# Altium schematic sheet KB1.SchDoc
size A1
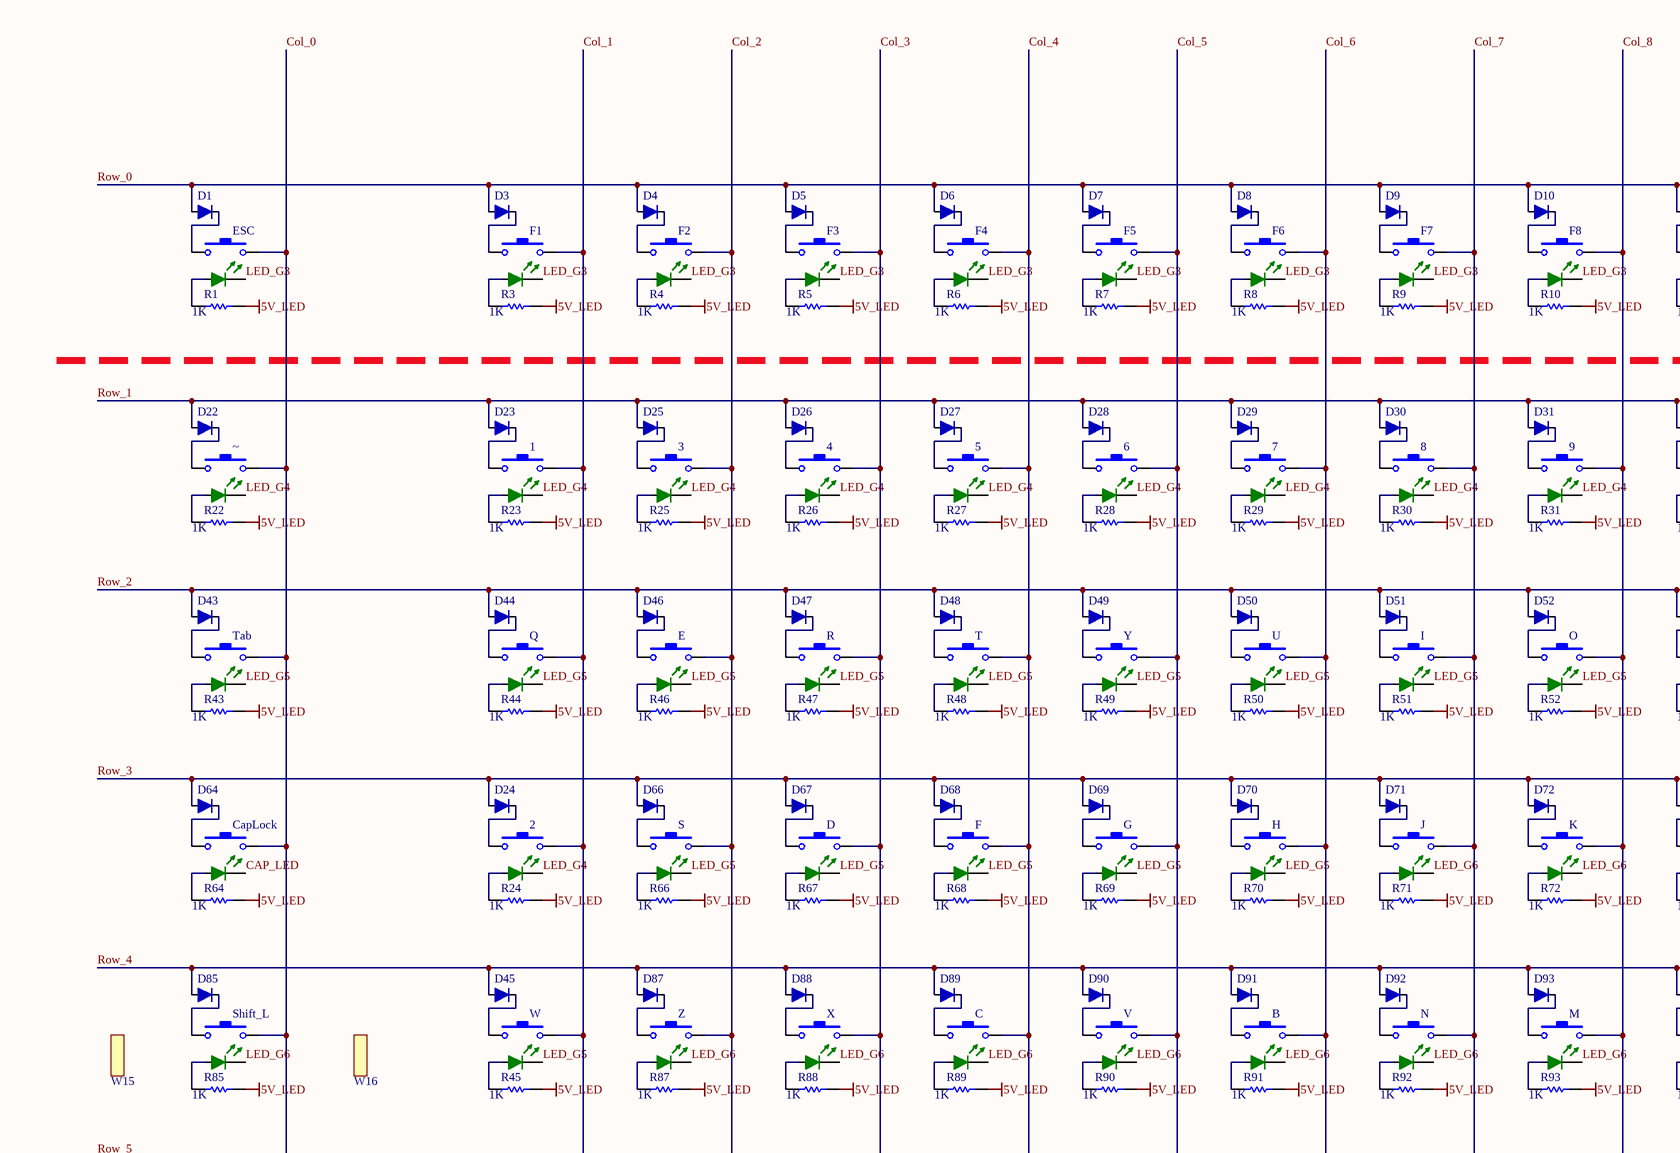
[diagram p0: KB1.SchDoc, top left]
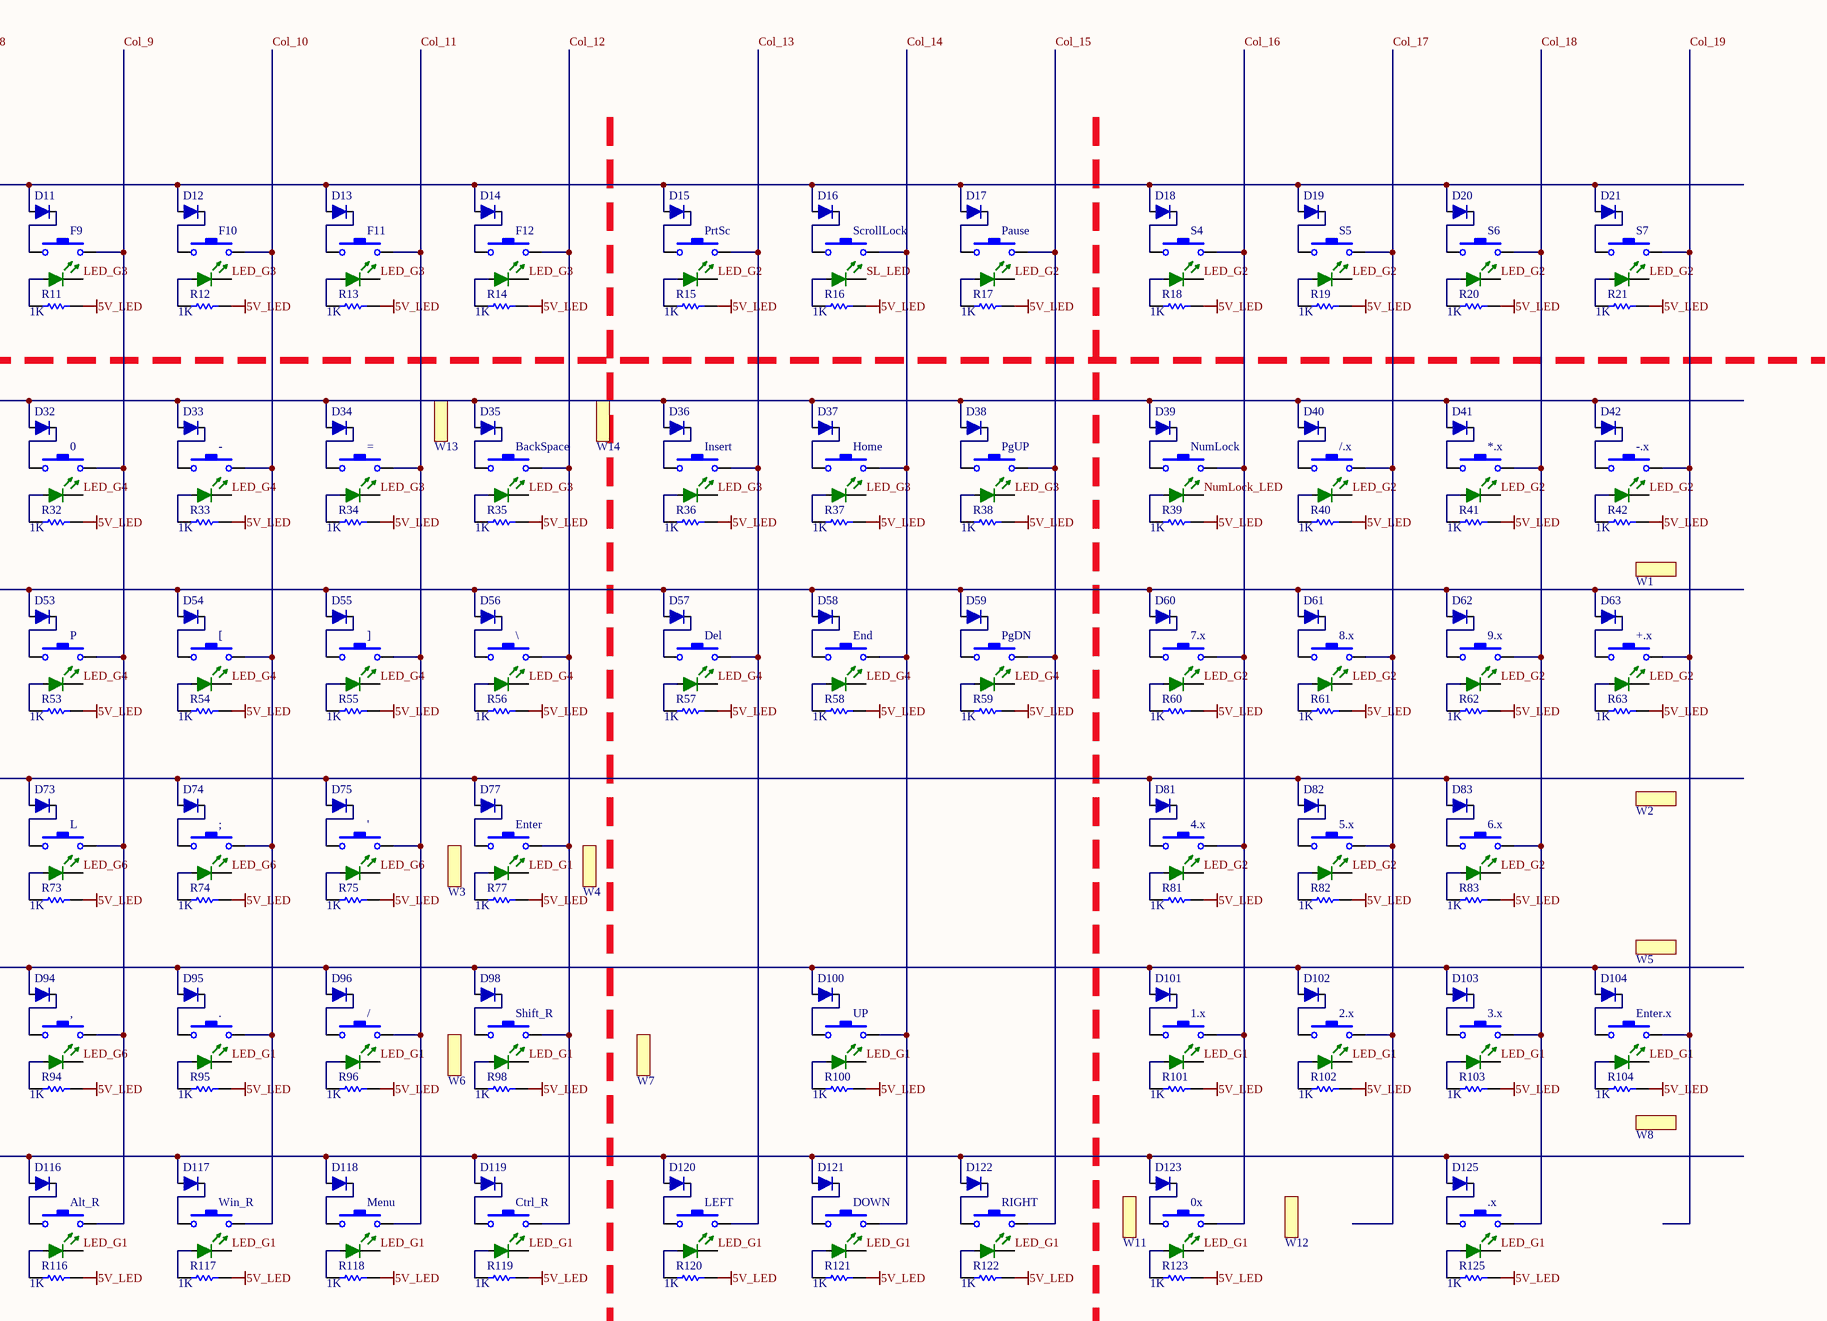
[diagram p1: KB1.SchDoc, top right]
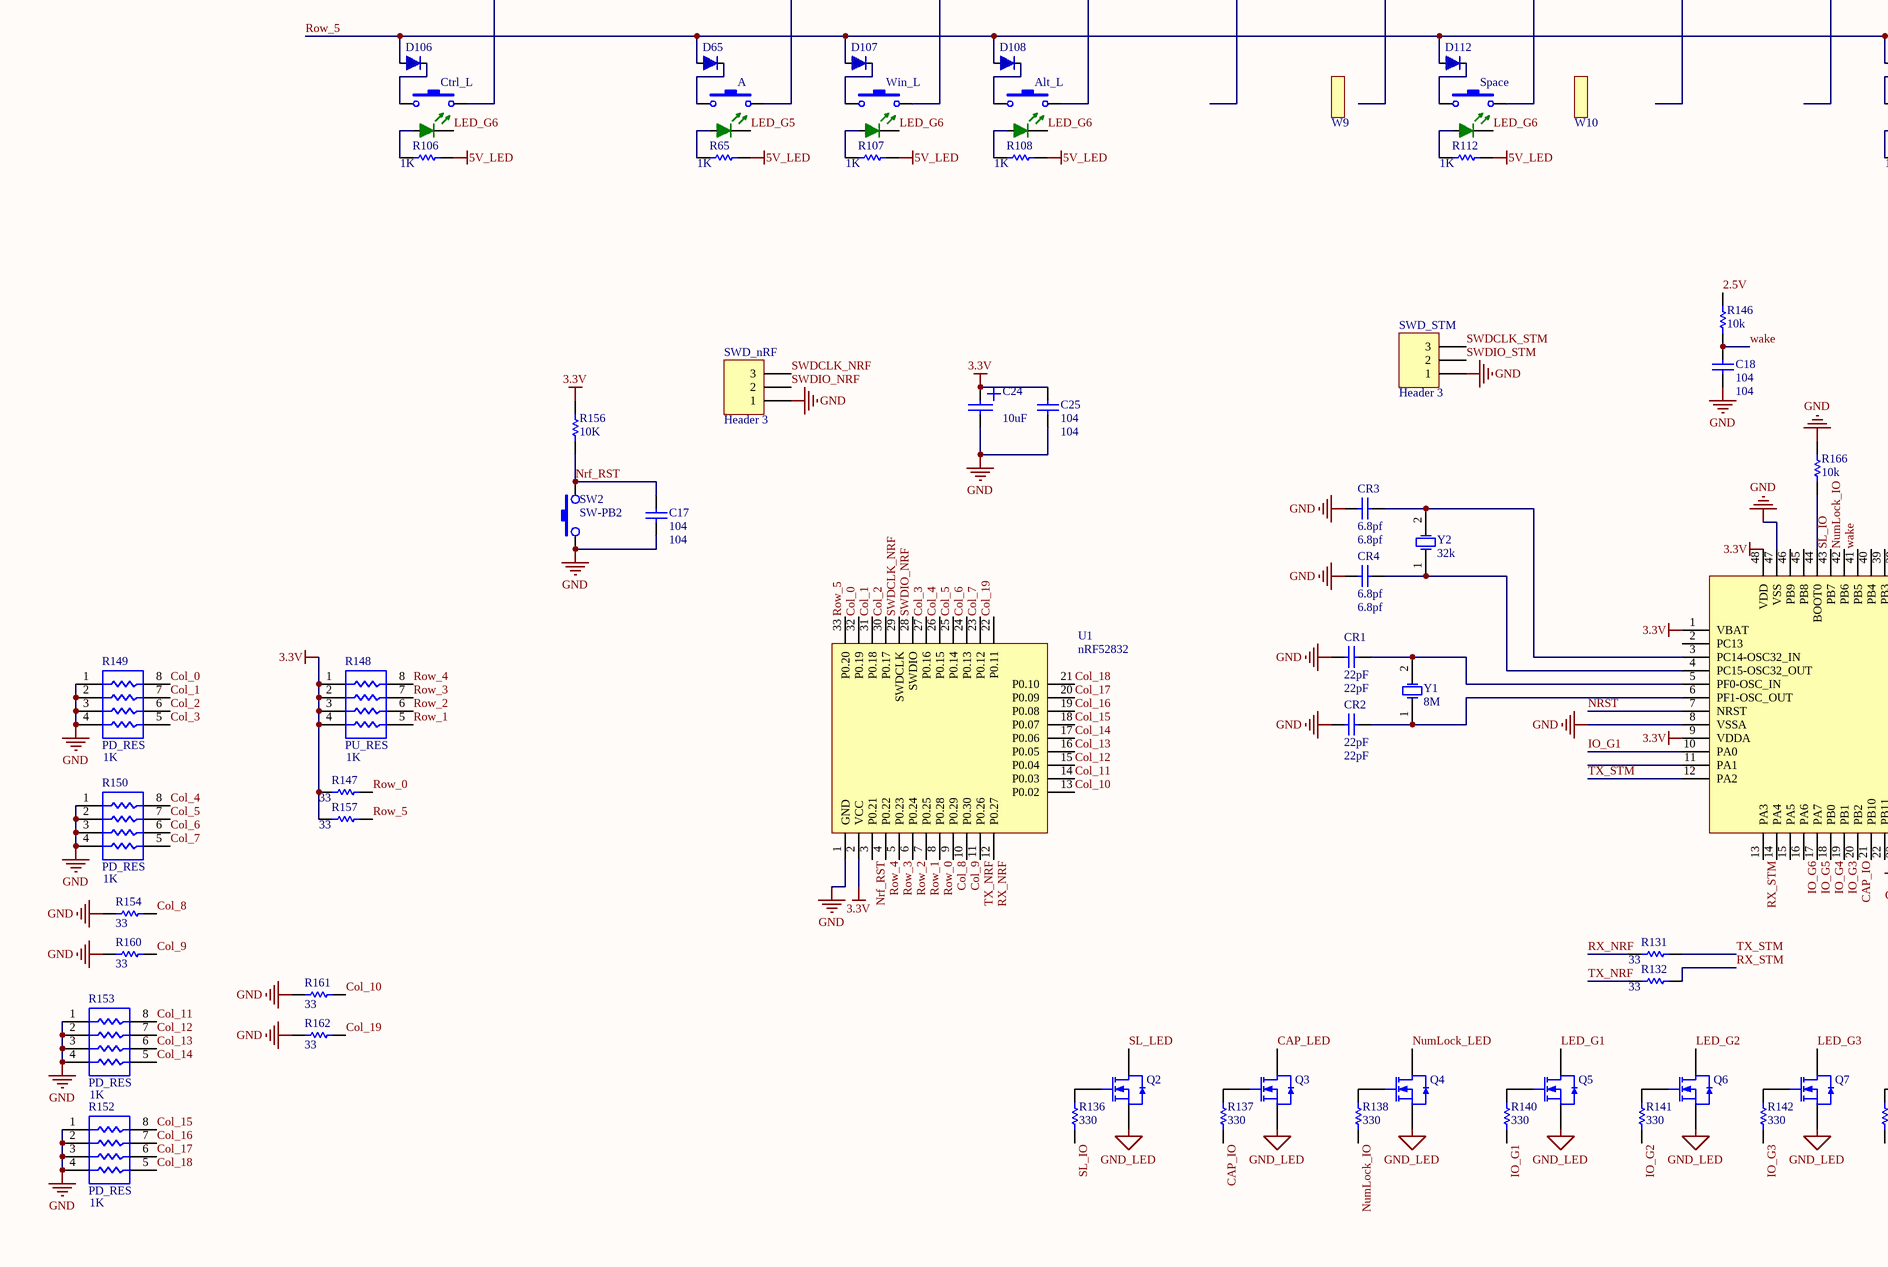
[diagram p2: KB1.SchDoc, bottom left]
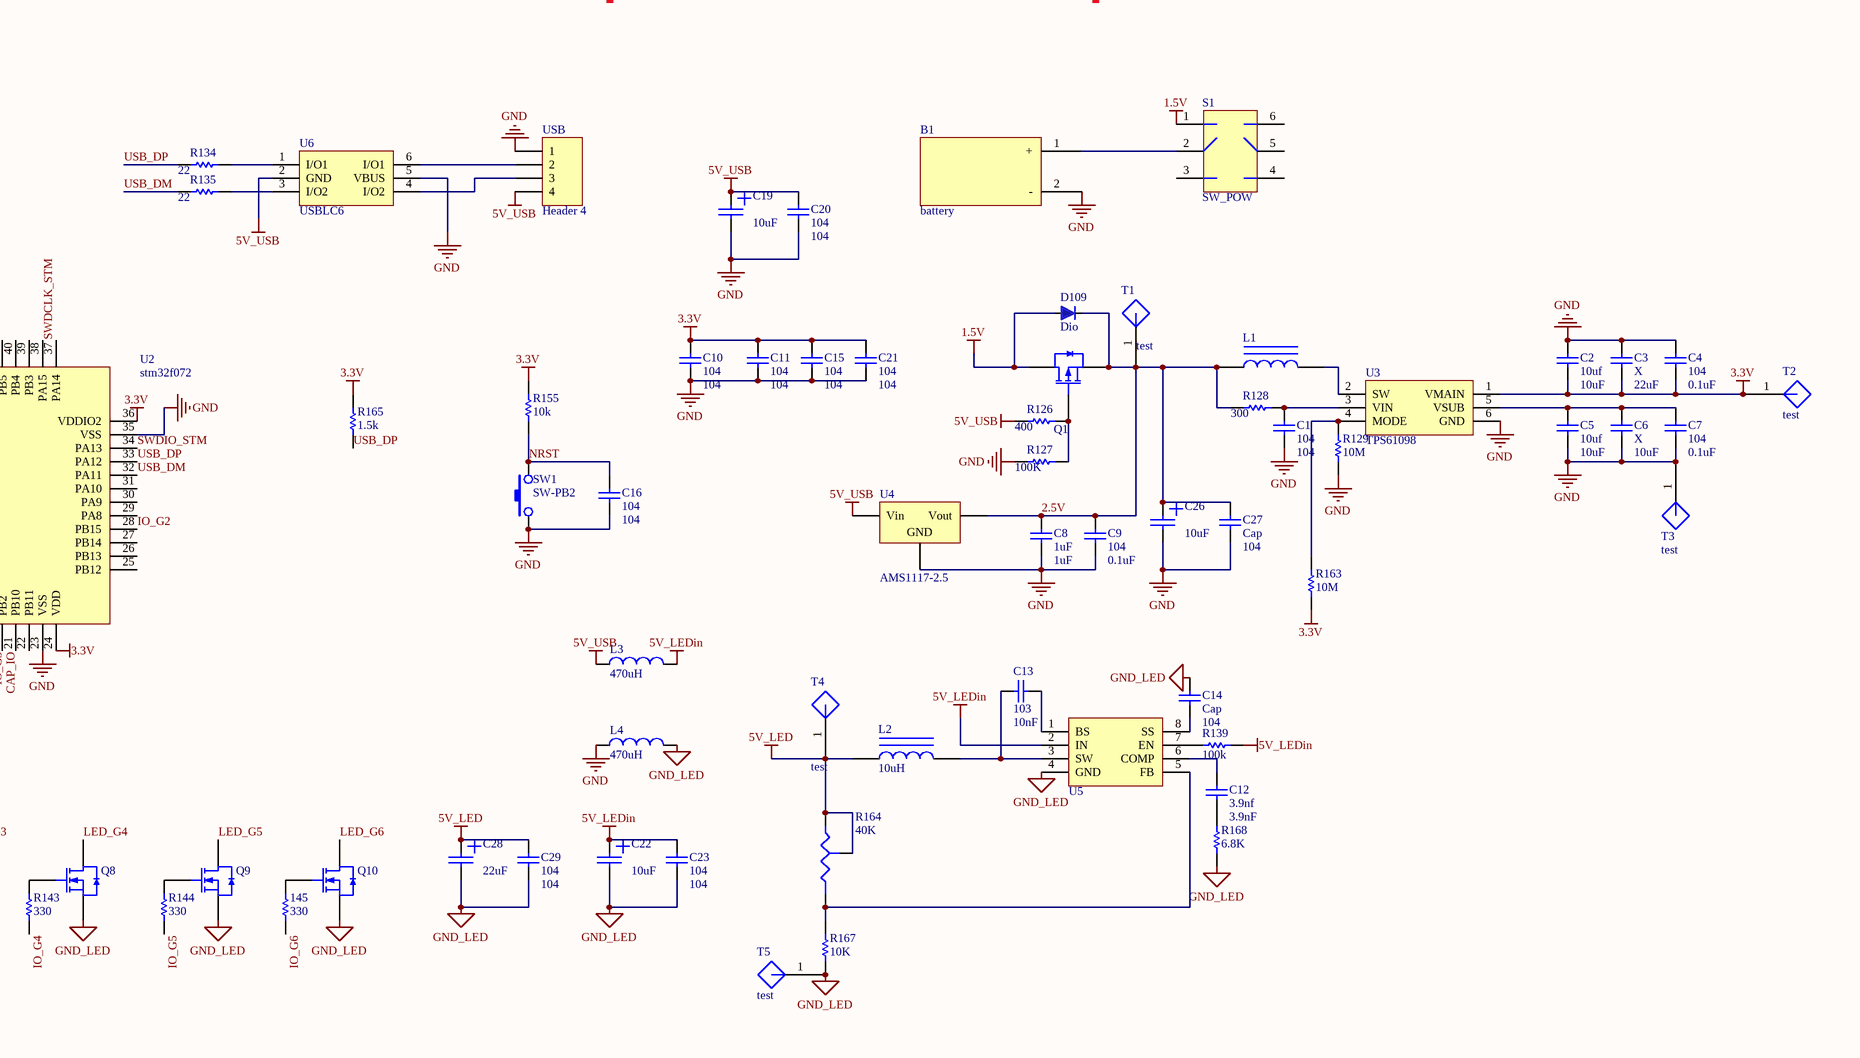
[diagram p3: KB1.SchDoc, bottom right]

## Parts
0  SW-PB  [mxkey]  (value not drawn)
0x  SW-PB  [mxkey]  (value not drawn)
1  SW-PB  [mxkey]  (value not drawn)
1.x  SW-PB  [mxkey]  (value not drawn)
2  SW-PB  [mxkey]  (value not drawn)
2.x  SW-PB  [mxkey]  (value not drawn)
3  SW-PB  [mxkey]  (value not drawn)
3.x  SW-PB  [mxkey]  (value not drawn)
4  SW-PB  [mxkey]  (value not drawn)
4.x  SW-PB  [mxkey]  (value not drawn)
5  SW-PB  [mxkey]  (value not drawn)
5.x  SW-PB  [mxkey]  (value not drawn)
6  SW-PB  [mxkey]  (value not drawn)
6.x  SW-PB  [mxkey]  (value not drawn)
7  SW-PB  [mxkey]  (value not drawn)
7.x  SW-PB  [mxkey]  (value not drawn)
8  SW-PB  [mxkey]  (value not drawn)
8.x  SW-PB  [mxkey]  (value not drawn)
9  SW-PB  [mxkey]  (value not drawn)
9.x  SW-PB  [mxkey]  (value not drawn)
145  330  [1608[0603]]
'  SW-PB  [mxkey]  (value not drawn)
*.x  SW-PB  [mxkey]  (value not drawn)
+.x  SW-PB  [mxkey]  (value not drawn)
,  SW-PB  [mxkey]  (value not drawn)
-  SW-PB  [mxkey]  (value not drawn)
-.x  SW-PB  [mxkey]  (value not drawn)
.  SW-PB  [mxkey]  (value not drawn)
.x  SW-PB  [mxkey]  (value not drawn)
/  SW-PB  [mxkey]  (value not drawn)
/.x  SW-PB  [mxkey]  (value not drawn)
;  SW-PB  [mxkey]  (value not drawn)
=  SW-PB  [mxkey]  (value not drawn)
[  SW-PB  [mxkey]  (value not drawn)
\  SW-PB  [mxkey]  (value not drawn)
]  SW-PB  [mxkey]  (value not drawn)
A  SW-PB  [mxkey]  (value not drawn)
Alt_L  SW-PB  [mxkey]  (value not drawn)
Alt_R  SW-PB  [mxkey]  (value not drawn)
B  SW-PB  [mxkey]  (value not drawn)
B1  battery  [AAA_battery_box_1]
BackSpace  SW-PB  [mxkey]  (value not drawn)
C  SW-PB  [mxkey]  (value not drawn)
C1  104  [6-0805_N]
C2  10uf  [1608[0603]]
C3  X  value 22uF  [1608[0603]]
C4  104  value 0.1uF  [1608[0603]]
C5  10uf  [1608[0603]]
C6  X  value 10uF  [1608[0603]]
C7  104  value 0.1uF  [1608[0603]]
C8  1uF  [1608[0603]]
C9  104  value 0.1uF  [1608[0603]]
C10  104  [1608[0603]]
C11  104  [1608[0603]]
C12  3.9nf  [1608[0603]]
C13  103  value 10nF  [1608[0603]]
C14  Cap  value 104  [1608[0603]]
C15  104  [1608[0603]]
C16  104  [1608[0603]]
C17  104  [1608[0603]]
C18  104  [1608[0603]]
C19  10uf  [3.2X1.6X1.1]
C20  104  [1608[0603]]
C21  104  [1608[0603]]
C22  10uf  [3.2X1.6X1.1]
C23  104  [1608[0603]]
C24  10Uf  [3.2X1.6X1.1]
C25  104  [1608[0603]]
C26  10uF  [3.2X1.6X1.1]
C27  Cap  value 104  [1608[0603]]
C28  value 22uF  [3.2X1.6X1.1]  (hidden comment: 10uf)
C29  104  [1608[0603]]
CapLock  SW-PB  [mxkey]  (value not drawn)
CR1  22pF  [6-0805_N]
CR2  22pF  [6-0805_N]
CR3  6.8pf  [6-0805_N]
CR4  6.8pf  [6-0805_N]
Ctrl_L  SW-PB  [mxkey]  (value not drawn)
Ctrl_R  SW-PB  [mxkey]  (value not drawn)
D  SW-PB  [mxkey]  (value not drawn)
D1  1n5819  [LL-34]  (value not drawn)
D3  1n5819  [LL-34]  (value not drawn)
D4  1n5819  [LL-34]  (value not drawn)
D5  1n5819  [LL-34]  (value not drawn)
D6  1n5819  [LL-34]  (value not drawn)
D7  1n5819  [LL-34]  (value not drawn)
D8  1n5819  [LL-34]  (value not drawn)
D9  1n5819  [LL-34]  (value not drawn)
D10  1n5819  [LL-34]  (value not drawn)
D11  1n5819  [LL-34]  (value not drawn)
D12  1n5819  [LL-34]  (value not drawn)
D13  1n5819  [LL-34]  (value not drawn)
D14  1n5819  [LL-34]  (value not drawn)
D15  1n5819  [LL-34]  (value not drawn)
D16  1n5819  [LL-34]  (value not drawn)
D17  1n5819  [LL-34]  (value not drawn)
D18  1n5819  [LL-34]  (value not drawn)
D19  1n5819  [LL-34]  (value not drawn)
D20  1n5819  [LL-34]  (value not drawn)
D21  1n5819  [LL-34]  (value not drawn)
D22  1n5819  [LL-34]  (value not drawn)
D23  1n5819  [LL-34]  (value not drawn)
D24  1n5819  [LL-34]  (value not drawn)
D25  1n5819  [LL-34]  (value not drawn)
D26  1n5819  [LL-34]  (value not drawn)
D27  1n5819  [LL-34]  (value not drawn)
D28  1n5819  [LL-34]  (value not drawn)
D29  1n5819  [LL-34]  (value not drawn)
D30  1n5819  [LL-34]  (value not drawn)
D31  1n5819  [LL-34]  (value not drawn)
D32  1n5819  [LL-34]  (value not drawn)
D33  1n5819  [LL-34]  (value not drawn)
D34  1n5819  [LL-34]  (value not drawn)
D35  1n5819  [LL-34]  (value not drawn)
D36  1n5819  [LL-34]  (value not drawn)
D37  1n5819  [LL-34]  (value not drawn)
D38  1n5819  [LL-34]  (value not drawn)
D39  1n5819  [LL-34]  (value not drawn)
D40  1n5819  [LL-34]  (value not drawn)
D41  1n5819  [LL-34]  (value not drawn)
D42  1n5819  [LL-34]  (value not drawn)
D43  1n5819  [LL-34]  (value not drawn)
D44  1n5819  [LL-34]  (value not drawn)
D45  1n5819  [LL-34]  (value not drawn)
D46  1n5819  [LL-34]  (value not drawn)
D47  1n5819  [LL-34]  (value not drawn)
D48  1n5819  [LL-34]  (value not drawn)
D49  1n5819  [LL-34]  (value not drawn)
D50  1n5819  [LL-34]  (value not drawn)
D51  1n5819  [LL-34]  (value not drawn)
D52  1n5819  [LL-34]  (value not drawn)
D53  1n5819  [LL-34]  (value not drawn)
D54  1n5819  [LL-34]  (value not drawn)
D55  1n5819  [LL-34]  (value not drawn)
D56  1n5819  [LL-34]  (value not drawn)
D57  1n5819  [LL-34]  (value not drawn)
D58  1n5819  [LL-34]  (value not drawn)
D59  1n5819  [LL-34]  (value not drawn)
D60  1n5819  [LL-34]  (value not drawn)
D61  1n5819  [LL-34]  (value not drawn)
D62  1n5819  [LL-34]  (value not drawn)
D63  1n5819  [LL-34]  (value not drawn)
D64  1n5819  [LL-34]  (value not drawn)
D65  1n5819  [LL-34]  (value not drawn)
D66  1n5819  [LL-34]  (value not drawn)
D67  1n5819  [LL-34]  (value not drawn)
D68  1n5819  [LL-34]  (value not drawn)
D69  1n5819  [LL-34]  (value not drawn)
D70  1n5819  [LL-34]  (value not drawn)
D71  1n5819  [LL-34]  (value not drawn)
D72  1n5819  [LL-34]  (value not drawn)
D73  1n5819  [LL-34]  (value not drawn)
D74  1n5819  [LL-34]  (value not drawn)
D75  1n5819  [LL-34]  (value not drawn)
D77  1n5819  [LL-34]  (value not drawn)
D81  1n5819  [LL-34]  (value not drawn)
D82  1n5819  [LL-34]  (value not drawn)
D83  1n5819  [LL-34]  (value not drawn)
D85  1n5819  [LL-34]  (value not drawn)
D87  1n5819  [LL-34]  (value not drawn)
D88  1n5819  [LL-34]  (value not drawn)
D89  1n5819  [LL-34]  (value not drawn)
D90  1n5819  [LL-34]  (value not drawn)
D91  1n5819  [LL-34]  (value not drawn)
D92  1n5819  [LL-34]  (value not drawn)
D93  1n5819  [LL-34]  (value not drawn)
D94  1n5819  [LL-34]  (value not drawn)
D95  1n5819  [LL-34]  (value not drawn)
D96  1n5819  [LL-34]  (value not drawn)
D98  1n5819  [LL-34]  (value not drawn)
D100  1n5819  [LL-34]  (value not drawn)
D101  1n5819  [LL-34]  (value not drawn)
D102  1n5819  [LL-34]  (value not drawn)
D103  1n5819  [LL-34]  (value not drawn)
D104  1n5819  [LL-34]  (value not drawn)
D106  1n5819  [LL-34]  (value not drawn)
D107  1n5819  [LL-34]  (value not drawn)
D108  1n5819  [LL-34]  (value not drawn)
D109  Dio  [SMA(DO-214AC)_S5]
D112  1n5819  [LL-34]  (value not drawn)
D116  1n5819  [LL-34]  (value not drawn)
D117  1n5819  [LL-34]  (value not drawn)
D118  1n5819  [LL-34]  (value not drawn)
D119  1n5819  [LL-34]  (value not drawn)
D120  1n5819  [LL-34]  (value not drawn)
D121  1n5819  [LL-34]  (value not drawn)
D122  1n5819  [LL-34]  (value not drawn)
D123  1n5819  [LL-34]  (value not drawn)
D125  1n5819  [LL-34]  (value not drawn)
Del  SW-PB  [mxkey]  (value not drawn)
DOWN  SW-PB  [mxkey]  (value not drawn)
E  SW-PB  [mxkey]  (value not drawn)
End  SW-PB  [mxkey]  (value not drawn)
Enter  SW-PB  [mxkey]  (value not drawn)
Enter.x  SW-PB  [mxkey]  (value not drawn)
ESC  SW-PB  [mxkey]  (value not drawn)
F  SW-PB  [mxkey]  (value not drawn)
F1  SW-PB  [mxkey]  (value not drawn)
F2  SW-PB  [mxkey]  (value not drawn)
F3  SW-PB  [mxkey]  (value not drawn)
F4  SW-PB  [mxkey]  (value not drawn)
F5  SW-PB  [mxkey]  (value not drawn)
F6  SW-PB  [mxkey]  (value not drawn)
F7  SW-PB  [mxkey]  (value not drawn)
F8  SW-PB  [mxkey]  (value not drawn)
F9  SW-PB  [mxkey]  (value not drawn)
F10  SW-PB  [mxkey]  (value not drawn)
F11  SW-PB  [mxkey]  (value not drawn)
F12  SW-PB  [mxkey]  (value not drawn)
G  SW-PB  [mxkey]  (value not drawn)
H  SW-PB  [mxkey]  (value not drawn)
Home  SW-PB  [mxkey]  (value not drawn)
I  SW-PB  [mxkey]  (value not drawn)
Insert  SW-PB  [mxkey]  (value not drawn)
J  SW-PB  [mxkey]  (value not drawn)
K  SW-PB  [mxkey]  (value not drawn)
L  SW-PB  [mxkey]  (value not drawn)
L1  Inductor Iron  [VLF302510MT]  (value not drawn)
L2  10uH  [0530]
L3  value 470uH  [C1812]  (hidden comment: INDUCTOR)
L4  value 470uH  [C1812]  (hidden comment: INDUCTOR)
LEFT  SW-PB  [mxkey]  (value not drawn)
M  SW-PB  [mxkey]  (value not drawn)
Menu  SW-PB  [mxkey]  (value not drawn)
N  SW-PB  [mxkey]  (value not drawn)
NumLock  SW-PB  [mxkey]  (value not drawn)
O  SW-PB  [mxkey]  (value not drawn)
P  SW-PB  [mxkey]  (value not drawn)
Pause  SW-PB  [mxkey]  (value not drawn)
PgDN  SW-PB  [mxkey]  (value not drawn)
PgUP  SW-PB  [mxkey]  (value not drawn)
PrtSc  SW-PB  [mxkey]  (value not drawn)
Q  SW-PB  [mxkey]  (value not drawn)
Q1  AO3401A P道沟 X13A15 SOT-23  [SOT-23-3L]  (value not drawn)
Q2  AO3400A N道沟 X0YV1T SOT-23  [SOT-23-3L]  (value not drawn)
Q3  AO3400A N道沟 X0YV1T SOT-23  [SOT-23-3L]  (value not drawn)
Q4  AO3400A N道沟 X0YV1T SOT-23  [SOT-23-3L]  (value not drawn)
Q5  AO3400A N道沟 X0YV1T SOT-23  [SOT-23-3L]  (value not drawn)
Q6  AO3400A N道沟 X0YV1T SOT-23  [SOT-23-3L]  (value not drawn)
Q7  AO3400A N道沟 X0YV1T SOT-23  [SOT-23-3L]  (value not drawn)
Q8  AO3400A N道沟 X0YV1T SOT-23  [SOT-23-3L]  (value not drawn)
Q9  AO3400A N道沟 X0YV1T SOT-23  [SOT-23-3L]  (value not drawn)
Q10  AO3400A N道沟 X0YV1T SOT-23  [SOT-23-3L]  (value not drawn)
R  SW-PB  [mxkey]  (value not drawn)
R1  value 1K  [6-0805_N]  (hidden comment: RES_KEY)
R3  value 1K  [6-0805_N]  (hidden comment: RES_KEY)
R4  value 1K  [6-0805_N]  (hidden comment: RES_KEY)
R5  value 1K  [6-0805_N]  (hidden comment: RES_KEY)
R6  value 1K  [6-0805_N]  (hidden comment: RES_KEY)
R7  value 1K  [6-0805_N]  (hidden comment: RES_KEY)
R8  value 1K  [6-0805_N]  (hidden comment: RES_KEY)
R9  value 1K  [6-0805_N]  (hidden comment: RES_KEY)
R10  value 1K  [6-0805_N]  (hidden comment: RES_KEY)
R11  value 1K  [6-0805_N]  (hidden comment: RES_KEY)
R12  value 1K  [6-0805_N]  (hidden comment: RES_KEY)
R13  value 1K  [6-0805_N]  (hidden comment: RES_KEY)
R14  value 1K  [6-0805_N]  (hidden comment: RES_KEY)
R15  value 1K  [6-0805_N]  (hidden comment: RES_KEY)
R16  value 1K  [6-0805_N]  (hidden comment: RES_KEY)
R17  value 1K  [6-0805_N]  (hidden comment: RES_KEY)
R18  value 1K  [6-0805_N]  (hidden comment: RES_KEY)
R19  value 1K  [6-0805_N]  (hidden comment: RES_KEY)
R20  value 1K  [6-0805_N]  (hidden comment: RES_KEY)
R21  value 1K  [6-0805_N]  (hidden comment: RES_KEY)
R22  value 1K  [6-0805_N]  (hidden comment: RES_KEY)
R23  value 1K  [6-0805_N]  (hidden comment: RES_KEY)
R24  value 1K  [6-0805_N]  (hidden comment: RES_KEY)
R25  value 1K  [6-0805_N]  (hidden comment: RES_KEY)
R26  value 1K  [6-0805_N]  (hidden comment: RES_KEY)
R27  value 1K  [6-0805_N]  (hidden comment: RES_KEY)
R28  value 1K  [6-0805_N]  (hidden comment: RES_KEY)
R29  value 1K  [6-0805_N]  (hidden comment: RES_KEY)
R30  value 1K  [6-0805_N]  (hidden comment: RES_KEY)
R31  value 1K  [6-0805_N]  (hidden comment: RES_KEY)
R32  value 1K  [6-0805_N]  (hidden comment: RES_KEY)
R33  value 1K  [6-0805_N]  (hidden comment: RES_KEY)
R34  value 1K  [6-0805_N]  (hidden comment: RES_KEY)
R35  value 1K  [6-0805_N]  (hidden comment: RES_KEY)
R36  value 1K  [6-0805_N]  (hidden comment: RES_KEY)
R37  value 1K  [6-0805_N]  (hidden comment: RES_KEY)
R38  value 1K  [6-0805_N]  (hidden comment: RES_KEY)
R39  value 1K  [6-0805_N]  (hidden comment: RES_KEY)
R40  value 1K  [6-0805_N]  (hidden comment: RES_KEY)
R41  value 1K  [6-0805_N]  (hidden comment: RES_KEY)
R42  value 1K  [6-0805_N]  (hidden comment: RES_KEY)
R43  value 1K  [6-0805_N]  (hidden comment: RES_KEY)
R44  value 1K  [6-0805_N]  (hidden comment: RES_KEY)
R45  value 1K  [6-0805_N]  (hidden comment: RES_KEY)
R46  value 1K  [6-0805_N]  (hidden comment: RES_KEY)
R47  value 1K  [6-0805_N]  (hidden comment: RES_KEY)
R48  value 1K  [6-0805_N]  (hidden comment: RES_KEY)
R49  value 1K  [6-0805_N]  (hidden comment: RES_KEY)
R50  value 1K  [6-0805_N]  (hidden comment: RES_KEY)
R51  value 1K  [6-0805_N]  (hidden comment: RES_KEY)
R52  value 1K  [6-0805_N]  (hidden comment: RES_KEY)
R53  value 1K  [6-0805_N]  (hidden comment: RES_KEY)
R54  value 1K  [6-0805_N]  (hidden comment: RES_KEY)
R55  value 1K  [6-0805_N]  (hidden comment: RES_KEY)
R56  value 1K  [6-0805_N]  (hidden comment: RES_KEY)
R57  value 1K  [6-0805_N]  (hidden comment: RES_KEY)
R58  value 1K  [6-0805_N]  (hidden comment: RES_KEY)
R59  value 1K  [6-0805_N]  (hidden comment: RES_KEY)
R60  value 1K  [6-0805_N]  (hidden comment: RES_KEY)
R61  value 1K  [6-0805_N]  (hidden comment: RES_KEY)
R62  value 1K  [6-0805_N]  (hidden comment: RES_KEY)
R63  value 1K  [6-0805_N]  (hidden comment: RES_KEY)
R64  value 1K  [6-0805_N]  (hidden comment: RES_KEY)
R65  value 1K  [6-0805_N]  (hidden comment: RES_KEY)
R66  value 1K  [6-0805_N]  (hidden comment: RES_KEY)
R67  value 1K  [6-0805_N]  (hidden comment: RES_KEY)
R68  value 1K  [6-0805_N]  (hidden comment: RES_KEY)
R69  value 1K  [6-0805_N]  (hidden comment: RES_KEY)
R70  value 1K  [6-0805_N]  (hidden comment: RES_KEY)
R71  value 1K  [6-0805_N]  (hidden comment: RES_KEY)
R72  value 1K  [6-0805_N]  (hidden comment: RES_KEY)
R73  value 1K  [6-0805_N]  (hidden comment: RES_KEY)
R74  value 1K  [6-0805_N]  (hidden comment: RES_KEY)
R75  value 1K  [6-0805_N]  (hidden comment: RES_KEY)
R77  value 1K  [6-0805_N]  (hidden comment: RES_KEY)
R81  value 1K  [6-0805_N]  (hidden comment: RES_KEY)
R82  value 1K  [6-0805_N]  (hidden comment: RES_KEY)
R83  value 1K  [6-0805_N]  (hidden comment: RES_KEY)
R85  value 1K  [6-0805_N]  (hidden comment: RES_KEY)
R87  value 1K  [6-0805_N]  (hidden comment: RES_KEY)
R88  value 1K  [6-0805_N]  (hidden comment: RES_KEY)
R89  value 1K  [6-0805_N]  (hidden comment: RES_KEY)
R90  value 1K  [6-0805_N]  (hidden comment: RES_KEY)
R91  value 1K  [6-0805_N]  (hidden comment: RES_KEY)
R92  value 1K  [6-0805_N]  (hidden comment: RES_KEY)
R93  value 1K  [6-0805_N]  (hidden comment: RES_KEY)
R94  value 1K  [6-0805_N]  (hidden comment: RES_KEY)
R95  value 1K  [6-0805_N]  (hidden comment: RES_KEY)
R96  value 1K  [6-0805_N]  (hidden comment: RES_KEY)
R98  value 1K  [6-0805_N]  (hidden comment: RES_KEY)
R100  value 1K  [6-0805_N]  (hidden comment: RES_KEY)
R101  value 1K  [6-0805_N]  (hidden comment: RES_KEY)
R102  value 1K  [6-0805_N]  (hidden comment: RES_KEY)
R103  value 1K  [6-0805_N]  (hidden comment: RES_KEY)
R104  value 1K  [6-0805_N]  (hidden comment: RES_KEY)
R106  value 1K  [6-0805_N]  (hidden comment: RES_KEY)
R107  value 1K  [6-0805_N]  (hidden comment: RES_KEY)
R108  value 1K  [6-0805_N]  (hidden comment: RES_KEY)
R112  value 1K  [6-0805_N]  (hidden comment: RES_KEY)
R116  value 1K  [6-0805_N]  (hidden comment: RES_KEY)
R117  value 1K  [6-0805_N]  (hidden comment: RES_KEY)
R118  value 1K  [6-0805_N]  (hidden comment: RES_KEY)
R119  value 1K  [6-0805_N]  (hidden comment: RES_KEY)
R120  value 1K  [6-0805_N]  (hidden comment: RES_KEY)
R121  value 1K  [6-0805_N]  (hidden comment: RES_KEY)
R122  value 1K  [6-0805_N]  (hidden comment: RES_KEY)
R123  value 1K  [6-0805_N]  (hidden comment: RES_KEY)
R125  value 1K  [6-0805_N]  (hidden comment: RES_KEY)
R126  400  [1608[0603]]
R127  100k  [1608[0603]]
R128  300  [6-0805_N]
R129  10M  [6-0805_N]
R131  33  [1608[0603]]
R132  33  [1608[0603]]
R134  22  [1608[0603]]
R135  22  [1608[0603]]
R136  330  [1608[0603]]
R137  330  [1608[0603]]
R138  330  [1608[0603]]
R139  100k  [1608[0603]]
R140  330  [1608[0603]]
R141  330  [1608[0603]]
R142  330  [1608[0603]]
R143  330  [1608[0603]]
R144  330  [1608[0603]]
R146  10k  [1608[0603]]
R147  value 33  [1608[0603]]  (hidden comment: PU_RES)
R148  PU_RES  value 1K  [0603_Rx4]
R149  PD_RES  value 1K  [0603_Rx4]
R150  PD_RES  value 1K  [0603_Rx4]
R152  PD_RES  value 1K  [0603_Rx4]
R153  PD_RES  value 1K  [0603_Rx4]
R154  value 33  [1608[0603]]  (hidden comment: PD_RES)
R155  10k  [1608[0603]]
R156  10K  [1608[0603]]
R157  value 33  [1608[0603]]  (hidden comment: PU_RES)
R160  value 33  [1608[0603]]  (hidden comment: PD_RES)
R161  value 33  [1608[0603]]  (hidden comment: PD_RES)
R162  value 33  [1608[0603]]  (hidden comment: PD_RES)
R163  value 10M  [6-0805_N]  (hidden comment: X)
R164  value 40K  [res_adj]  (hidden comment: Res Tap)
R165  value 1.5k  [6-0805_N]  (hidden comment: X)
R166  10k  [6-0805_N]
R167  10k  [1608[0603]]
R168  6.8k  [1608[0603]]
RIGHT  SW-PB  [mxkey]  (value not drawn)
S  SW-PB  [mxkey]  (value not drawn)
S1  SW_POW  [SW_POWER]
S4  SW-PB  [mxkey]  (value not drawn)
S5  SW-PB  [mxkey]  (value not drawn)
S6  SW-PB  [mxkey]  (value not drawn)
S7  SW-PB  [mxkey]  (value not drawn)
ScrollLock  SW-PB  [mxkey]  (value not drawn)
Shift_L  SW-PB  [mxkey]  (value not drawn)
Shift_R  SW-PB  [mxkey]  (value not drawn)
Space  SW-PB  [mxkey]  (value not drawn)
SW1  SW-PB2  [SW2P]
SW2  SW-PB2  [SW2P]
SWD_nRF  Header 3  [HDR1X3]
SWD_STM  Header 3  [HDR1X3]
T  SW-PB  [mxkey]  (value not drawn)
T1  test  [SIP1]
T2  test  [SIP1]
T3  test  [SIP1]
T4  test  [SIP1]
T5  test  [SIP1]
Tab  SW-PB  [mxkey]  (value not drawn)
U  SW-PB  [mxkey]  (value not drawn)
U1  nRF52832  [RF_BM_ND01C]
U2  stm32f072  [LQFP-48_7x7x05P]
U3  TPS61098  [SON-6N]
U4  AMS1117-2.5  [SOT-223]
U5  MP2307DN  [SOIC-8_150mil]  (value not drawn)
U6  USBLC6  [SOT-23-6]
UP  SW-PB  [mxkey]  (value not drawn)
USB  Header 4  [PH2.0_4P]
V  SW-PB  [mxkey]  (value not drawn)
W  SW-PB  [mxkey]  (value not drawn)
W1  weixing  [weixing]  (value not drawn)
W2  weixing  [weixing]  (value not drawn)
W3  weixing  [weixing]  (value not drawn)
W4  weixing  [weixing]  (value not drawn)
W5  weixing  [weixing]  (value not drawn)
W6  weixing  [weixing]  (value not drawn)
W7  weixing  [weixing]  (value not drawn)
W8  weixing  [weixing]  (value not drawn)
W9  weixing  [weixing]  (value not drawn)
W10  weixing  [weixing]  (value not drawn)
W11  weixing  [weixing]  (value not drawn)
W12  weixing  [weixing]  (value not drawn)
W13  weixing  [weixing]  (value not drawn)
W14  weixing  [weixing]  (value not drawn)
W15  weixing  [weixing]  (value not drawn)
W16  weixing  [weixing]  (value not drawn)
Win_L  SW-PB  [mxkey]  (value not drawn)
Win_R  SW-PB  [mxkey]  (value not drawn)
X  SW-PB  [mxkey]  (value not drawn)
Y  SW-PB  [mxkey]  (value not drawn)
Y1  8M  [SMD-3215_2P FC - 135]
Y2  32k  [SMD-3215_2P FC - 135]
Z  SW-PB  [mxkey]  (value not drawn)
~  SW-PB  [mxkey]  (value not drawn)

## Nets
1.5V: D109.A Q1.3(D) S1.1
3.3V: C2.1 C3.1 C4.1 C10.2 C11.2 C15.2 C21.2 C24.1 C25.2 R147.1 R148.1 R148.2 R148.3 R148.4 R155.2 R156.2 R157.1 R163.1 R165.2 T2.1 U1.2(VCC) U2.1(VBAT) U2.9(VDDA) U2.24(VDD) U2.36(VDDIO2) U2.48(VDD) U3.1(VMAIN)
5V_LED: C28.1 C29.2 L2.1 R1.2 R3.2 R4.2 R5.2 R6.2 R7.2 R8.2 R9.2 R10.2 R11.2 R12.2 R13.2 R14.2 R15.2 R16.2 R17.2 R18.2 R19.2 R20.2 R21.2 R22.2 R23.2 R24.2 R25.2 R26.2 R27.2 R28.2 R29.2 R30.2 R31.2 R32.2 R33.2 R34.2 R35.2 R36.2 R37.2 R38.2 R39.2 R40.2 R41.2 R42.2 R43.2 R44.2 R45.2 R46.2 R47.2 R48.2 R49.2 R50.2 R51.2 R52.2 R53.2 R54.2 R55.2 R56.2 R57.2 R58.2 R59.2 R60.2 R61.2 R62.2 R63.2 R64.2 R65.2 R66.2 R67.2 R68.2 R69.2 R70.2 R71.2 R72.2 R73.2 R74.2 R75.2 R77.2 R81.2 R82.2 R83.2 R85.2 R87.2 R88.2 R89.2 R90.2 R91.2 R92.2 R93.2 R94.2 R95.2 R96.2 R98.2 R100.2 R101.2 R102.2 R103.2 R104.2 R106.2 R107.2 R108.2 R112.2 R116.2 R117.2 R118.2 R119.2 R120.2 R121.2 R122.2 R123.2 R125.2 R164.1(A) R164.2(TAP) T4.1
5V_LEDin: C22.1 C23.2 L3.2 R139.1 U5.2(IN)
5V_USB: C19.1 C20.2 L3.1 R126.1 U4.3(Vin) U6.2(GND) USB.4
GND: B1.2(-) C1.1 C2.2 C3.2 C4.2 C5.1 C6.1 C7.1 C8.1 C9.1 C10.1 C11.1 C15.1 C16.1 C17.1 C18.1 C19.2 C20.1 C21.1 C24.2 C25.1 C26.2 C27.1 CR1.2 CR2.2 CR3.2 CR4.2 L4.1 R127.1 R129.1 R149.1 R149.2 R149.3 R149.4 R150.1 R150.2 R150.3 R150.4 R152.1 R152.2 R152.3 R152.4 R153.1 R153.2 R153.3 R153.4 R154.2 R160.2 R161.2 R162.2 R166.2 SW1.1 SW2.1 SWD_nRF.1 SWD_STM.1 T3.1 U1.1(GND) U2.8(VSSA) U2.23(VSS) U2.35(VSS) U2.47(VSS) U3.6(GND) U4.1(GND) U6.5(VBUS) USB.1
GND_LED: C14.2 C22.2 C23.1 C28.2 C29.1 L4.2 Q2.2(S) Q3.2(S) Q4.2(S) Q5.2(S) Q6.2(S) Q7.2(S) Q8.2(S) Q9.2(S) Q10.2(S) R167.1 R168.1 T5.1 U5.4(GND)
2.5V: C8.2 C9.2 C26.1 C27.2 D109.K L1.1 Q1.2(S) R128.1 R146.2 T1.1 U4.2(Vout)
CAP_IO: R137.1 U2.20(PB2)
CAP_LED: CapLock.K Q3.3(D)
Col_0: CapLock.2 Ctrl_L.2 ESC.2 R149.8 Shift_L.2 Tab.2 U1.32(P0.19) ~.2
Col_1: 1.2 2.2 A.2 F1.2 Q.2 R149.7 U1.31(P0.18) W.2
Col_2: 3.2 E.2 F2.2 R149.6 S.2 U1.30(P0.17) Win_L.2 Z.2
Col_3: 4.2 Alt_L.2 D.2 F3.2 R.2 R149.5 U1.27(P0.16) X.2
Col_4: 5.2 C.2 F.2 F4.2 R150.8 T.2 U1.26(P0.15)
Col_5: 6.2 F5.2 G.2 R150.7 U1.25(P0.14) V.2 Y.2
Col_6: 7.2 B.2 F6.2 H.2 R150.6 Space.2 U.2 U1.24(P0.13)
Col_7: 8.2 F7.2 I.2 J.2 N.2 R150.5 U1.23(P0.12)
Col_8: 9.2 F8.2 K.2 M.2 O.2 R154.1 U1.9(P0.29)
Col_9: 0.2 ,.2 Alt_R.2 F9.2 L.2 P.2 R160.1 U1.10(P0.30)
Col_10: -.2 ..2 ;.2 [.2 F10.2 R161.1 U1.13(P0.02) Win_R.2
Col_11: '.2 /.2 =.2 ].2 F11.2 Menu.2 R153.8 U1.14(P0.03)
Col_12: \.2 BackSpace.2 Ctrl_R.2 Enter.2 F12.2 R153.7 Shift_R.2 U1.15(P0.04)
Col_13: Del.2 Insert.2 LEFT.2 PrtSc.2 R153.6 U1.16(P0.05)
Col_14: DOWN.2 End.2 Home.2 R153.5 ScrollLock.2 U1.17(P0.06) UP.2
Col_15: Pause.2 PgDN.2 PgUP.2 R152.8 RIGHT.2 U1.18(P0.07)
Col_16: 0x.2 1.x.2 4.x.2 7.x.2 NumLock.2 R152.7 S4.2 U1.19(P0.08)
Col_17: 2.x.2 5.x.2 8.x.2 /.x.2 R152.6 S5.2 U1.20(P0.09)
Col_18: 3.x.2 6.x.2 9.x.2 *.x.2 .x.2 R152.5 S6.2 U1.21(P0.10)
Col_19: +.x.2 -.x.2 Enter.x.2 R162.1 S7.2 U1.22(P0.11)
IO_G1: R140.1 U2.10(PA0)
IO_G2: R141.1 U2.28(PB15)
IO_G3: R142.1 U2.19(PB1)
IO_G4: R143.1 U2.18(PB0)
IO_G5: R144.1 U2.17(PA7)
IO_G6: 145.1 U2.16(PA6)
LED_G1: 0x.K 1.x.K 2.x.K 3.x.K ..K .x.K /.K Alt_R.K Ctrl_R.K DOWN.K Enter.K Enter.x.K LEFT.K Menu.K Q5.3(D) RIGHT.K Shift_R.K UP.K Win_R.K
LED_G2: 4.x.K 5.x.K 6.x.K 7.x.K 8.x.K 9.x.K *.x.K +.x.K -.x.K /.x.K Pause.K PrtSc.K Q6.3(D) S4.K S5.K S6.K S7.K
LED_G3: =.K BackSpace.K ESC.K F1.K F2.K F3.K F4.K F5.K F6.K F7.K F8.K F9.K F10.K F11.K F12.K Home.K Insert.K PgUP.K Q7.3(D)
LED_G4: 0.K 1.K 2.K 3.K 4.K 5.K 6.K 7.K 8.K 9.K -.K [.K \.K ].K Del.K End.K P.K PgDN.K Q8.3(D) ~.K
LED_G5: A.K D.K E.K F.K G.K H.K I.K O.K Q.K Q9.3(D) R.K S.K T.K Tab.K U.K W.K Y.K
LED_G6: '.K ,.K ;.K Alt_L.K B.K C.K Ctrl_L.K J.K K.K L.K M.K N.K Q10.3(D) Shift_L.K Space.K V.K Win_L.K X.K Z.K
Nrf_RST: C17.2 R156.1 SW2.2 U1.3(P0.21)
NRST: C16.2 R155.1 SW1.2 U2.7(NRST)
NumLock_IO: R138.1 U2.42(PB6)
NumLock_LED: NumLock.K Q4.3(D)
Row_0: D1.A D3.A D4.A D5.A D6.A D7.A D8.A D9.A D10.A D11.A D12.A D13.A D14.A D15.A D16.A D17.A D18.A D19.A D20.A D21.A R147.2 U1.8(P0.28)
Row_1: D22.A D23.A D25.A D26.A D27.A D28.A D29.A D30.A D31.A D32.A D33.A D34.A D35.A D36.A D37.A D38.A D39.A D40.A D41.A D42.A R148.5 U1.7(P0.25)
Row_2: D43.A D44.A D46.A D47.A D48.A D49.A D50.A D51.A D52.A D53.A D54.A D55.A D56.A D57.A D58.A D59.A D60.A D61.A D62.A D63.A R148.6 U1.6(P0.24)
Row_3: D24.A D64.A D66.A D67.A D68.A D69.A D70.A D71.A D72.A D73.A D74.A D75.A D77.A D81.A D82.A D83.A R148.7 U1.5(P0.23)
Row_4: D45.A D85.A D87.A D88.A D89.A D90.A D91.A D92.A D93.A D94.A D95.A D96.A D98.A D100.A D101.A D102.A D103.A D104.A R148.8 U1.4(P0.22)
Row_5: D65.A D106.A D107.A D108.A D112.A D116.A D117.A D118.A D119.A D120.A D121.A D122.A D123.A D125.A R157.2 U1.33(P0.20)
RX_NRF: R131.1 U1.12(P0.27)
RX_STM: R132.2 U2.13(PA3)
SL_IO: R136.1 U2.43(PB7)
SL_LED: Q2.3(D) ScrollLock.K
SWDCLK_NRF: SWD_nRF.3 U1.29(SWDCLK)
SWDCLK_STM: SWD_STM.3 U2.37(PA14)
SWDIO_NRF: SWD_nRF.2 U1.28(SWDIO)
SWDIO_STM: SWD_STM.2 U2.34(PA13)
TX_NRF: R132.1 U1.11(P0.26)
TX_STM: R131.2 U2.12(PA2)
USB_DM: R135.1 U2.32(PA11)
USB_DP: R134.1 R165.1 U2.33(PA12)
wake: C18.2 R146.1 U2.41(PB5)
Net0_1: 0.1 D32.K
Net0_A: 0.A R32.1
Net0x_1: 0x.1 D123.K
Net0x_A: 0x.A R123.1
Net1.x_1: 1.x.1 D101.K
Net1.x_A: 1.x.A R101.1
Net1_1: 1.1 D23.K
Net1_A: 1.A R23.1
Net2.x_1: 2.x.1 D102.K
Net2.x_A: 2.x.A R102.1
Net2_1: 2.1 D24.K
Net2_A: 2.A R24.1
Net3.x_1: 3.x.1 D103.K
Net3.x_A: 3.x.A R103.1
Net3_1: 3.1 D25.K
Net3_A: 3.A R25.1
Net4.x_1: 4.x.1 D81.K
Net4.x_A: 4.x.A R81.1
Net4_1: 4.1 D26.K
Net4_A: 4.A R26.1
Net5.x_1: 5.x.1 D82.K
Net5.x_A: 5.x.A R82.1
Net5_1: 5.1 D27.K
Net5_A: 5.A R27.1
Net6.x_1: 6.x.1 D83.K
Net6.x_A: 6.x.A R83.1
Net6_1: 6.1 D28.K
Net6_A: 6.A R28.1
Net7.x_1: 7.x.1 D60.K
Net7.x_A: 7.x.A R60.1
Net7_1: 7.1 D29.K
Net7_A: 7.A R29.1
Net8.x_1: 8.x.1 D61.K
Net8.x_A: 8.x.A R61.1
Net8_1: 8.1 D30.K
Net8_A: 8.A R30.1
Net9.x_1: 9.x.1 D62.K
Net9.x_A: 9.x.A R62.1
Net9_1: 9.1 D31.K
Net9_A: 9.A R31.1
Net145_2: 145.2 Q10.1(G)
Net'_1: '.1 D75.K
Net'_A: '.A R75.1
Net*.x_1: *.x.1 D41.K
Net*.x_A: *.x.A R41.1
Net+.x_1: +.x.1 D63.K
Net+.x_A: +.x.A R63.1
Net,_1: ,.1 D94.K
Net,_A: ,.A R94.1
Net-.x_1: -.x.1 D42.K
Net-.x_A: -.x.A R42.1
Net-_1: -.1 D33.K
Net-_A: -.A R33.1
Net._1: ..1 D95.K
Net._A: ..A R95.1
Net.x_1: .x.1 D125.K
Net.x_A: .x.A R125.1
Net/.x_1: /.x.1 D40.K
Net/.x_A: /.x.A R40.1
Net/_1: /.1 D96.K
Net/_A: /.A R96.1
Net;_1: ;.1 D74.K
Net;_A: ;.A R74.1
Net=_1: =.1 D34.K
Net=_A: =.A R34.1
Net[_1: [.1 D54.K
Net[_A: [.A R54.1
Ne~{t}_1: \.1 D56.K
Ne~{t}_A: \.A R56.1
Net]_1: ].1 D55.K
Net]_A: ].A R55.1
NetA_1: A.1 D65.K
NetA_A: A.A R65.1
NetAlt_L_1: Alt_L.1 D108.K
NetAlt_L_A: Alt_L.A R108.1
NetAlt_R_1: Alt_R.1 D116.K
NetAlt_R_A: Alt_R.A R116.1
NetB1_1: B1.1(+) S1.2
NetB_1: B.1 D91.K
NetB_A: B.A R91.1
NetBackSpace_1: BackSpace.1 D35.K
NetBackSpace_A: BackSpace.A R35.1
NetC1_2: C1.2 R128.2 U3.3(VIN)
NetC5_2: C5.2 C6.2 C7.2 U3.5(VSUB)
NetC12_1: C12.1 R168.2
NetC12_2: C12.2 U5.6(COMP)
NetC13_1: C13.1 U5.1(BS)
NetC13_2: C13.2 L2.2 U5.3(SW)
NetC14_1: C14.1 U5.8(SS)
NetC_1: C.1 D89.K
NetC_A: C.A R89.1
NetCapLock_1: CapLock.1 D64.K
NetCapLock_A: CapLock.A R64.1
NetCR1_1: CR1.1 U2.5(PF0-OSC_IN) Y1.2(OSC2)
NetCR2_1: CR2.1 U2.6(PF1-OSC_OUT) Y1.1(OSC1)
NetCR3_1: CR3.1 U2.3(PC14-OSC32_IN) Y2.2(OSC2)
NetCR4_1: CR4.1 U2.4(PC15-OSC32_OUT) Y2.1(OSC1)
NetCtrl_L_1: Ctrl_L.1 D106.K
NetCtrl_L_A: Ctrl_L.A R106.1
NetCtrl_R_1: Ctrl_R.1 D119.K
NetCtrl_R_A: Ctrl_R.A R119.1
NetD1_K: D1.K ESC.1
NetD3_K: D3.K F1.1
NetD4_K: D4.K F2.1
NetD5_K: D5.K F3.1
NetD6_K: D6.K F4.1
NetD7_K: D7.K F5.1
NetD8_K: D8.K F6.1
NetD9_K: D9.K F7.1
NetD10_K: D10.K F8.1
NetD11_K: D11.K F9.1
NetD12_K: D12.K F10.1
NetD13_K: D13.K F11.1
NetD14_K: D14.K F12.1
NetD15_K: D15.K PrtSc.1
NetD16_K: D16.K ScrollLock.1
NetD17_K: D17.K Pause.1
NetD18_K: D18.K S4.1
NetD19_K: D19.K S5.1
NetD20_K: D20.K S6.1
NetD21_K: D21.K S7.1
NetD22_K: D22.K ~.1
NetD36_K: D36.K Insert.1
NetD37_K: D37.K Home.1
NetD38_K: D38.K PgUP.1
NetD39_K: D39.K NumLock.1
NetD43_K: D43.K Tab.1
NetD44_K: D44.K Q.1
NetD45_K: D45.K W.1
NetD46_K: D46.K E.1
NetD47_K: D47.K R.1
NetD48_K: D48.K T.1
NetD49_K: D49.K Y.1
NetD50_K: D50.K U.1
NetD51_K: D51.K I.1
NetD52_K: D52.K O.1
NetD53_K: D53.K P.1
NetD57_K: D57.K Del.1
NetD58_K: D58.K End.1
NetD59_K: D59.K PgDN.1
NetD66_K: D66.K S.1
NetD68_K: D68.K F.1
NetD69_K: D69.K G.1
NetD70_K: D70.K H.1
NetD71_K: D71.K J.1
NetD72_K: D72.K K.1
NetD73_K: D73.K L.1
NetD77_K: D77.K Enter.1
NetD85_K: D85.K Shift_L.1
NetD87_K: D87.K Z.1
NetD88_K: D88.K X.1
NetD90_K: D90.K V.1
NetD92_K: D92.K N.1
NetD93_K: D93.K M.1
NetD98_K: D98.K Shift_R.1
NetD100_K: D100.K UP.1
NetD104_K: D104.K Enter.x.1
NetD107_K: D107.K Win_L.1
NetD112_K: D112.K Space.1
NetD117_K: D117.K Win_R.1
NetD118_K: D118.K Menu.1
NetD120_K: D120.K LEFT.1
NetD121_K: D121.K DOWN.1
NetD122_K: D122.K RIGHT.1
NetD_1: D.1 D67.K
NetD_A: D.A R67.1
NetDel_A: Del.A R57.1
NetDOWN_A: DOWN.A R121.1
NetE_A: E.A R46.1
NetEnd_A: End.A R58.1
NetEnter.x_A: Enter.x.A R104.1
NetEnter_A: Enter.A R77.1
NetESC_A: ESC.A R1.1
NetF1_A: F1.A R3.1
NetF2_A: F2.A R4.1
NetF3_A: F3.A R5.1
NetF4_A: F4.A R6.1
NetF5_A: F5.A R7.1
NetF6_A: F6.A R8.1
NetF7_A: F7.A R9.1
NetF8_A: F8.A R10.1
NetF9_A: F9.A R11.1
NetF10_A: F10.A R12.1
NetF11_A: F11.A R13.1
NetF12_A: F12.A R14.1
NetF_A: F.A R68.1
NetG_A: G.A R69.1
NetH_A: H.A R70.1
NetHome_A: Home.A R37.1
NetI_A: I.A R51.1
NetInsert_A: Insert.A R36.1
NetJ_A: J.A R71.1
NetK_A: K.A R72.1
NetL1_2: L1.2 U3.2(SW)
NetL_A: L.A R73.1
NetLEFT_A: LEFT.A R120.1
NetM_A: M.A R93.1
NetMenu_A: Menu.A R118.1
NetN_A: N.A R92.1
NetNumLock_A: NumLock.A R39.1
NetO_A: O.A R52.1
NetP_A: P.A R53.1
NetPause_A: Pause.A R17.1
NetPgDN_A: PgDN.A R59.1
NetPgUP_A: PgUP.A R38.1
NetPrtSc_A: PrtSc.A R15.1
NetQ1_1: Q1.1(G) R126.2 R127.2
NetQ2_1: Q2.1(G) R136.2
NetQ3_1: Q3.1(G) R137.2
NetQ4_1: Q4.1(G) R138.2
NetQ5_1: Q5.1(G) R140.2
NetQ6_1: Q6.1(G) R141.2
NetQ7_1: Q7.1(G) R142.2
NetQ8_1: Q8.1(G) R143.2
NetQ9_1: Q9.1(G) R144.2
NetQ_A: Q.A R44.1
NetR16_1: R16.1 ScrollLock.A
NetR18_1: R18.1 S4.A
NetR19_1: R19.1 S5.A
NetR20_1: R20.1 S6.A
NetR21_1: R21.1 S7.A
NetR22_1: R22.1 ~.A
NetR43_1: R43.1 Tab.A
NetR45_1: R45.1 W.A
NetR48_1: R48.1 T.A
NetR49_1: R49.1 Y.A
NetR50_1: R50.1 U.A
NetR66_1: R66.1 S.A
NetR85_1: R85.1 Shift_L.A
NetR87_1: R87.1 Z.A
NetR88_1: R88.1 X.A
NetR90_1: R90.1 V.A
NetR98_1: R98.1 Shift_R.A
NetR100_1: R100.1 UP.A
NetR107_1: R107.1 Win_L.A
NetR112_1: R112.1 Space.A
NetR117_1: R117.1 Win_R.A
NetR122_1: R122.1 RIGHT.A
NetR129_2: R129.2 R163.2 U3.4(MODE)
NetR134_2: R134.2 U6.1(I/O1)
NetR135_2: R135.2 U6.3(I/O2)
NetR139_2: R139.2 U5.7(EN)
NetR164_3: R164.3(B) R167.2 U5.5(FB)
NetR166_1: R166.1 U2.44(BOOT0)
NetR_A: R.A R47.1
NetU6_4: U6.4(I/O2) USB.3
NetU6_6: U6.6(I/O1) USB.2

Not connected (* = marked no-connect by the designer): S1 3 4 5 6; U2 2(PC13) 11(PA1) 14(PA4) 15(PA5) 21(PB10) 22(PB11) 25(PB12) 26(PB13) 27(PB14) 29(PA8) 30(PA9) 31(PA10) 38(PA15) 39(PB3) 40(PB4) 45(PB8) 46(PB9)

## Library data of the parts
0 0x 1 1.x 2 2.x 3 3.x 4 4.x 5 5.x 6 6.x 7 7.x 8 8.x 9 9.x ' *.x +.x , - -.x . .x / /.x ; = [ \ ] A Alt_L Alt_R B BackSpace C CapLock Ctrl_L Ctrl_R D Del DOWN E End Enter Enter.x ESC F F1-F12 G H Home I Insert J K L LEFT M Menu N NumLock O P Pause PgDN PgUP PrtSc Q R RIGHT S S4-S7 ScrollLock Shift_L Shift_R Space T Tab U UP V W Win_L Win_R X Y Z ~ = SW-PB: Switch; Published: 24-Mar-1999; LatestRevisionDate: 17-Jul-2002; LatestRevisionNote: Re-released for DXP Platform.; PackageReference: SPST-2; Publisher: Altium Limited; PackageDescription: Switch; 2 Leads
145 R1 R3-R75 R77 R81-R83 R85 R87-R96 R98 R100-R104 R106-R108 R112 R116-R123 R125-R129 R131 R132 R134-R144 R146 R147 R154-R157 R160-R163 R165-R168 = Res1: Resistor; Published: 8-Jun-2000; LatestRevisionDate: 17-Jul-2002; LatestRevisionNote: Re-released for DXP Platform.; PackageReference: AXIAL-0.3; Publisher: Altium Limited; PackageDescription: Axial Device, Thru-Hole; 2 Leads; 0.3 in Pin Spacing
  145 R136-R138 R140-R144: Value: 330
  R126: Value: 400
  R127: Value: 100K
  R128: Value: 300
  R129: Value: 10M
  R131 R132: Value: 33
  R134 R135: Value: 22
  R139: Value: 100k
  R146 R155 R166: Value: 10k
  R156 R167: Value: 10K
  R168: Value: 6.8K
C1-C18 C20 C21 C23 C25 C27 C29 CR1-CR4 = Cap: Capacitor; Published: 8-Jun-2000; LatestRevisionDate: 17-Jul-2002; LatestRevisionNote: Re-released for DXP Platform.; PackageReference: RAD-0.3; Publisher: Altium Limited; PackageDescription: Radial Cap, Thru-Hole; 2 Leads; 0.3 in Pin Spacing
  C1 C10 C11 C15-C18 C20 C21 C23 C25 C29: Value: 104
  C2 C5: Value: 10uF
  C8: Value: 1uF
  C12: Value: 3.9nF
  CR1 CR2: Value: 22pF
  CR3 CR4: Value: 6.8pf
C19 C22 C24 C26 C28 = CAP3216: pin to pad: 1>2 2>1
  C19 C22 C24 C26: Value: 10uF
D1 D3-D75 D77 D81-D83 D85 D87-D96 D98 D100-D104 D106-D108 D112 D116-D123 D125 = Dio: pin to pad: A>1 K>2
L1 L2 = Inductor Iron: Magnetic-Core Inductor; Published: 24-Mar-1999; LatestRevisionDate: 17-Jul-2002; LatestRevisionNote: Re-released for DXP Platform.; PackageReference: AXIAL-0.9; Publisher: Altium Limited; PackageDescription: Axial Device, Thru-Hole; 2 Leads; 0.9 in Pin Spacing
Q1 = AO3401A P道沟 X13A15 SOT-23: MOS(场效应管); ComponentLink1Description: 供应商链接; ComponentLink1URL: http://www.szlcsc.com/product/details_15801.html; Package: SOT-23; Supplier: LC; SuppliersPartNumber: C15127
Q2-Q10 = AO3400A N道沟 X0YV1T SOT-23: MOS(场效应管); ComponentLink1Description: 供应商链接; ComponentLink1URL: http://www.szlcsc.com/product/details_21629.html; Package: SOT-23; Supplier: LC; SuppliersPartNumber: C20917
R148-R150 R152 R153 = Res Pack3: Isolated Resistor Network; Published: 24-Mar-1999; LatestRevisionDate: 29-May-2009; LatestRevisionNote: IPC-7351 Footprint Added.; PackageReference: SO-16; Publisher: Altium Limited; PackageDescription: 16-Pin Small Outline Integrated Circuit 1.27 mm Pitch; Code_JEDEC: MS-012-AC; Code_IPC: SOIC127P600-16
R164 = Res Tap: Tapped Resistor; Sim Note: Enter the Resistance value and the set point into parameter fields.; Set Position: 0.5; Published: 24-Mar-1999; LatestRevisionDate: 17-Jul-2002; LatestRevisionNote: Re-released for DXP Platform.; PackageReference: VR3; Publisher: Altium Limited; PackageDescription: Variable Resistor, Thru-Hole; 3 Leads
SWD_nRF SWD_STM = Header 3: Header, 3-Pin; LatestRevisionDate: 17-Jul-2002; LatestRevisionNote: Re-released for DXP Platform.; Publisher: Altium Limited
U1 = RF-BM-ND04
U4 = SOT-223 AMS1117-3.3: 低压差线性稳压(LDO); ComponentLink1Description: 供应商链接; ComponentLink1URL: http://www.szlcsc.com/product/details_6652.html; Package: SOT-223; Supplier: LC; SuppliersPartNumber: C6186
USB = Header 4: Header, 4-Pin; LatestRevisionDate: 17-Jul-2002; LatestRevisionNote: Re-released for DXP Platform.; Publisher: Altium Limited
Y1 Y2 = XTAL: Crystal Oscillator; Published: 8-Jun-2000; LatestRevisionDate: 17-Jul-2002; LatestRevisionNote: Re-released for DXP Platform.; PackageReference: R38; Publisher: Altium Limited; PackageDescription: Crystal, Thru-Hole; 2 Leads; Body 3.1 x 8.2 mm (Dia.xH)